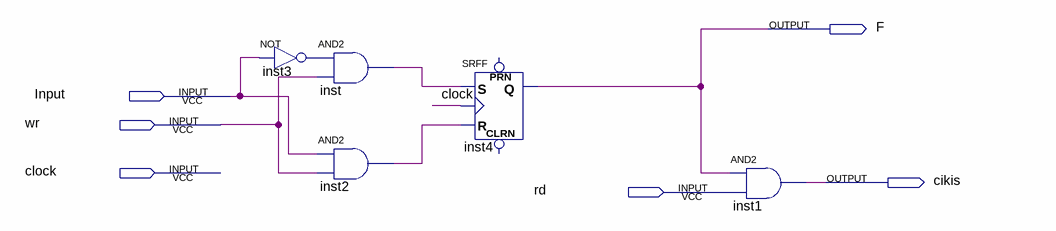
[diagram p0: schematic sheet]
// Quartus schematic hucreDevre.bdf as structural Verilog: 5 symbols, 6 pins
module hucreDevre (
  input  Input,
  input  wr,
  input  clock,
  input  rd,
  output F,
  output cikis
);

  wire inst2_out, inst3_out, inst_out;

  and inst (inst_out, inst3_out, wr);
  not inst3 (inst3_out, Input);
  and inst2 (inst2_out, Input, wr);
  SRFF inst4 (.S(inst_out), .R(inst2_out), .CLK(clock), .Q(F));  // open: PRN, CLRN
  and inst1 (cikis, F, rd);
endmodule
